# Altium project LED_Clock.PrjPcb
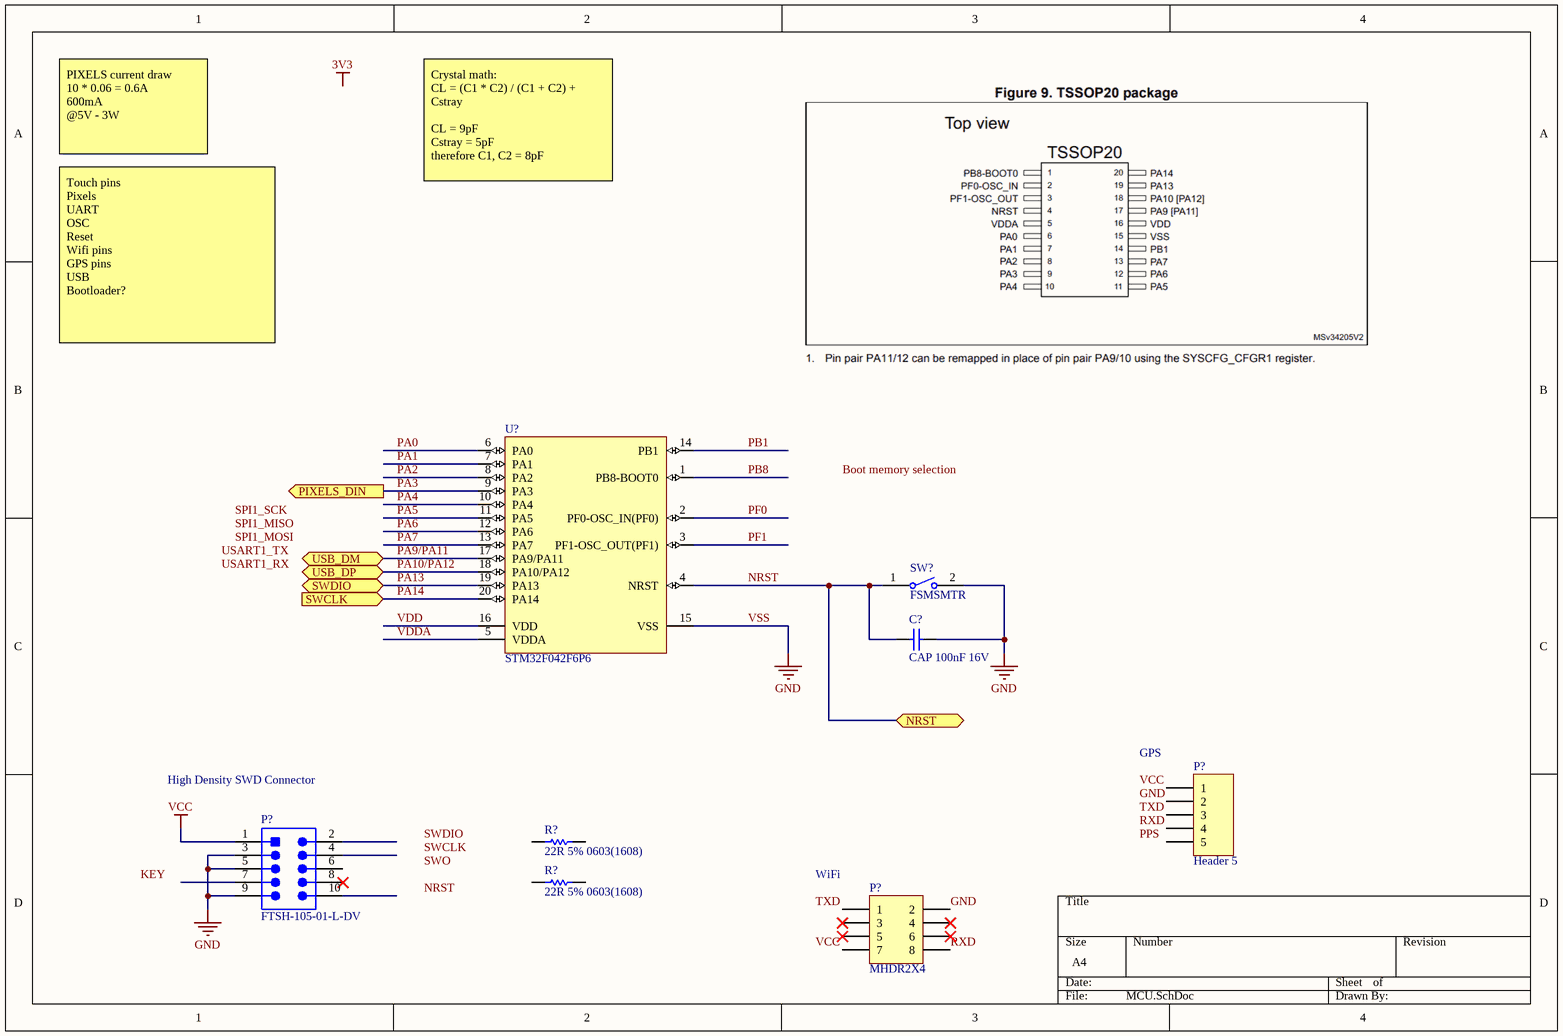
[diagram p0: MCU.SchDoc]
5 sheets, 31 parts. Net scope: flat (ports and power ports of the same name join across sheets).
Sheets:
  MCU.SchDoc
  Pixels.SchDoc
  Peripherals.SchDoc
  Power.SchDoc
  TouchSensing.SchDoc

## Sheet MCU.SchDoc
size A4

### Parts
(Parts that share a designator on the sheet are numbered #1, #2 ... from top to bottom, then left to right.)
C?#1  CAP 100nF 16V  [CAPC0603(1608)100_N]
P?#1  Header 5  [HDR1X5]
P?#2  FTSH-105-01-L-DV  [SMTC-FTSH-105-01-L-DV_V]
P?#3  MHDR2X4  [MHDR2X4]
R?#1  22R 5% 0603(1608)  [RESC0603(1608)_N]
R?#2  22R 5% 0603(1608)  [RESC0603(1608)_N]
SW?  FSMSMTR  [TECO-FSMSMTR_V]
U?#1  STM32F042F6P6  [STM-TSSOP20_M]

### Ports
NRST (bidir), PIXELS_DIN (out), SWCLK (in), SWDIO (bidir), USB_DM (bidir), USB_DP (bidir)

### Nets
GND: C?#1.2 P?#2.3 P?#2.5 P?#2.9 P?#3.2 SW?.2 U?#1.15(VSS)  [also labelled VSS]
VCC: P?#2.1
NRST: C?#1.1 SW?.1 U?#1.4(NRST) ; port NRST
PA0: U?#1.6(PA0)
PA1: U?#1.7(PA1)
PA2: U?#1.8(PA2)
PA3: U?#1.9(PA3) ; port PIXELS_DIN
PA4: U?#1.10(PA4)
PA5: U?#1.11(PA5)
PA6: U?#1.12(PA6)
PA7: U?#1.13(PA7)
PA9/PA11: U?#1.17(PA9/PA11) ; port USB_DM  [project net PA11]
PA10/PA12: U?#1.18(PA10/PA12) ; port USB_DP
PA13: U?#1.19(PA13) ; port SWDIO
PA14: U?#1.20(PA14) ; port SWCLK
PB1: U?#1.14(PB1)
PB8: U?#1.1(PB8-BOOT0)
PF0: U?#1.2(PF0-OSC_IN(PF0))
PF1: U?#1.3(PF1-OSC_OUT(PF1))
RXD: P?#3.8
VDD: U?#1.16(VDD)
VDDA: U?#1.5(VDDA)

Not connected (* = marked no-connect by the designer): P?#1 1 2 3 4 5; P?#2 2 4 6 7 8* 10; P?#3 1 3* 4* 5* 6* 7; R?#1 1 2; R?#2 1 2

### Notes on the sheet
- PIXELS current draw
  10 * 0.06 = 0.6A
  600mA
  @5V - 3W
- Crystal math:
  CL = (C1 * C2) / (C1 + C2) + Cstray
  CL = 9pF
  Cstray = 5pF
  therefore C1, C2 = 8pF
- Touch pins
  Pixels
  UART
  OSC
  Reset
  Wifi pins
  GPS pins
  USB
  Bootloader?
- High Density SWD Connector
- (near P?#1) GPS
- (near P?#3) WiFi
- Labels drawn without touching a wire or pin: 3V3, Boot memory selection, GND, KEY, NRST, PPS, RXD, SPI1_MISO, SPI1_MOSI, SPI1_SCK, SWCLK, SWDIO, SWO, TXD, USART1_RX, USART1_TX, VCC

### Library data of the parts
C?#1 = CMP-1035-02584-1: CAP 100nF 16V ±10% 0603 (1608 Metric) Thickness 1mm SMD; Tolerance: Â±10%; Case-EIA: 0603; Case-Metric: 1608; Technology: SMT; Max Thickness: 1 mm; Value: 100nF; Rated Voltage: 16 V
P?#1 = Header 5: Header, 5-Pin; LatestRevisionDate: 17-Jul-2002; LatestRevisionNote: Re-released for DXP Platform.; Publisher: Altium Limited
P?#2 = CMP-2000-05354-1: Male Header, Pitch 1.27 mm, 2 x 5 Position, Height 5.96 mm, -55 to 125 degC, RoHS, Bulk; Manufacturer: Samtec; Connector Type: Header,Unshrouded; Pitch: 0.050"(1.27mm); Mating Products: FLE-105-01-G-DV-TR-ND-CONNSKT1.27MM10POSDUALSMDCLP-105-02-G-D-P-TR-ND-CONNRCPT10POSDUAL.05"SMDSFMC-105-L2-S-D-TR-ND-CONN.05"SURFACE10POSSMTSFMH-105-02-L-D-TR-ND-CONNRECEPT10POS.50"SMTFLE-105-01-G-DV-A-ND-CONNSKT1.27MM10POSDUALSMDCLP-105-02-G-D-BE-ND-CONNRCPT10POSDUAL.05"SMDFLE-105-01-G-DV-A-P-ND-CONNSKT1.27MM10POSDUALSMDSAM1153-05-ND-CONNRCPT10POSDUAL.05"SMDSAM1155-05-ND-CONNRCPT10POSDUAL.05"SMDSAM1154-05-ND-CONNRCPT10POSDUAL.05"SMDSFMH-105-02-L-D-LC-ND-CONNRECEPT10POS.50"SMTSAM1226-05-ND-CONNRCPT.05"10POSDUALSMD; Catalog Drawings: FTSHSeriesFTSHSeriesSMTSide; Other Names: SAM1161-05; EDA / CAD Models: DownloadfromAcceleratedDesigns; Number of Positions Loaded: All; Number of Positions: 10; Featured Product: Board-To-BoardInterconnectSystems; Online Catalog: FTSHSeries; Product Training Modules: Board-to-BoardConnectors; Category: Connectors,Interconnects; Number of Rows: 2; Contact Finish: Gold; Termination: Solder; Mounting Type: SurfaceMount; Series: FTSH; Contact Mating Length: 0.120"(3.05mm); Row Spacing: 0.050"(1.27mm); Datasheet URL: https://datasheet.ciiva.com/30493/0900766b80adfe36-30493006.pdf; Contact Finish Thickness: 10µin(0.25µm); Features: -; Standard Package: 1; Packaging: Bulk; Datasheet Version: Feb-08; Manufacturer URL: http://www.samtec.com/; Fastening Type: -; Family: RectangularConnectors-Headers,MalePins; Contact Type: MalePin; Color: Black
P?#3 = MHDR2X4: Header, 4-Pin, Dual row; LatestRevisionDate: 17-Jul-2002; LatestRevisionNote: Re-released for DXP Platform.; Publisher: Altium Limited
R?#1 R?#2 = CMP-1012-00034-1: 22R 0.1W 5% 0603 (1608 Metric)  SMD; Value: 22.00 Ohm; Case-EIA: 0603; Case-Metric: 1608; Technology: SMT; Power: 0.1 W; Tolerance: 5 %
SW? = CMP-2000-07501-1: FSMSM Push Button Switch, 50 mA, -35 to 85 degC, 2-Pin SMD, RoHS, Tape and Reel; Manufacturer: TE Connectivity; Voltage Rating (DC): 24V; Electrical Life: 20000Cycles; Operating Force: 180gf; Switch Travel: 0.25mm; Contact Current Rating: 50mA; Case\/Package: SMD/SMT; Actuator Length: 1.07mm; Throw Configuration: SPST; Actuator Material: Polyamide; Contact Resistance: 100mOhm; Illumination Type: Illuminated; Max Voltage Rating (DC): 12V; Manufacturer URL: http://www.te.com/; Lead Free: LeadFree; Packaging: TapeandReel; Min Operating Temperature: -35degC; Mechanical Life: 20000Cycles; Mount: SurfaceMount; REACH SVHC: Unknown; Package Quantity: 1800; Package Reference: FSMSMTR; RoHSCompliant: true; Max Operating Temperature: 85degC; Orientation: Straight; ELV: Compliant; Datasheet URL: http://www.te.com/commerce/DocumentDelivery/DDEController?Action=showdoc&DocId=Customer+Drawing%7F1437566-3%7FC2%7Fpdf%7FEnglish%7FENG_CD_1437566-3_C2_1437566_3_1_c.dwg.pdf%7F1437566-4; Package Description: 2-Pin Surface Mount Device, Body 6 x 3.5 mm, Pitch 9.19 mm; Current Rating: 50mA; Contact Plating: Silver; Termination: GullWing; Datasheet Version: Rev. C2, 08/2014; Contact Material: Brass; Mounting Technology: SurfaceMount
U?#1 = CMP-0304-00108-2: ARM Cortex-M0 32-bit MCU, 32 KB Flash, 6 KB Internal RAM, 16 I/Os, 20-Pin TSSOP, -40 to 85 degC, Tube; Manufacturer: STMicroelectronics; Package Description: 20-Pin Thin Shrink Small Outline Package, Body 6.5 x 4.4 mm, Pitch 0.65 mm; ComponentLink1URL: http://www.st.com/; ComponentLink2Description: Datasheet; Package Reference: TSSOP20; ComponentLink2URL: http://www.st.com/st-web-ui/static/active/en/resource/technical/document/datasheet/DM00105814.pdf; ComponentLink1Description: Manufacturer URL; Mounting Technology: Surface Mount; Core: ARM Cortex-M0; PartNumber: STM32F042F6P6; DatasheetVersion: Rev. 5

## Sheet Pixels.SchDoc
size A4
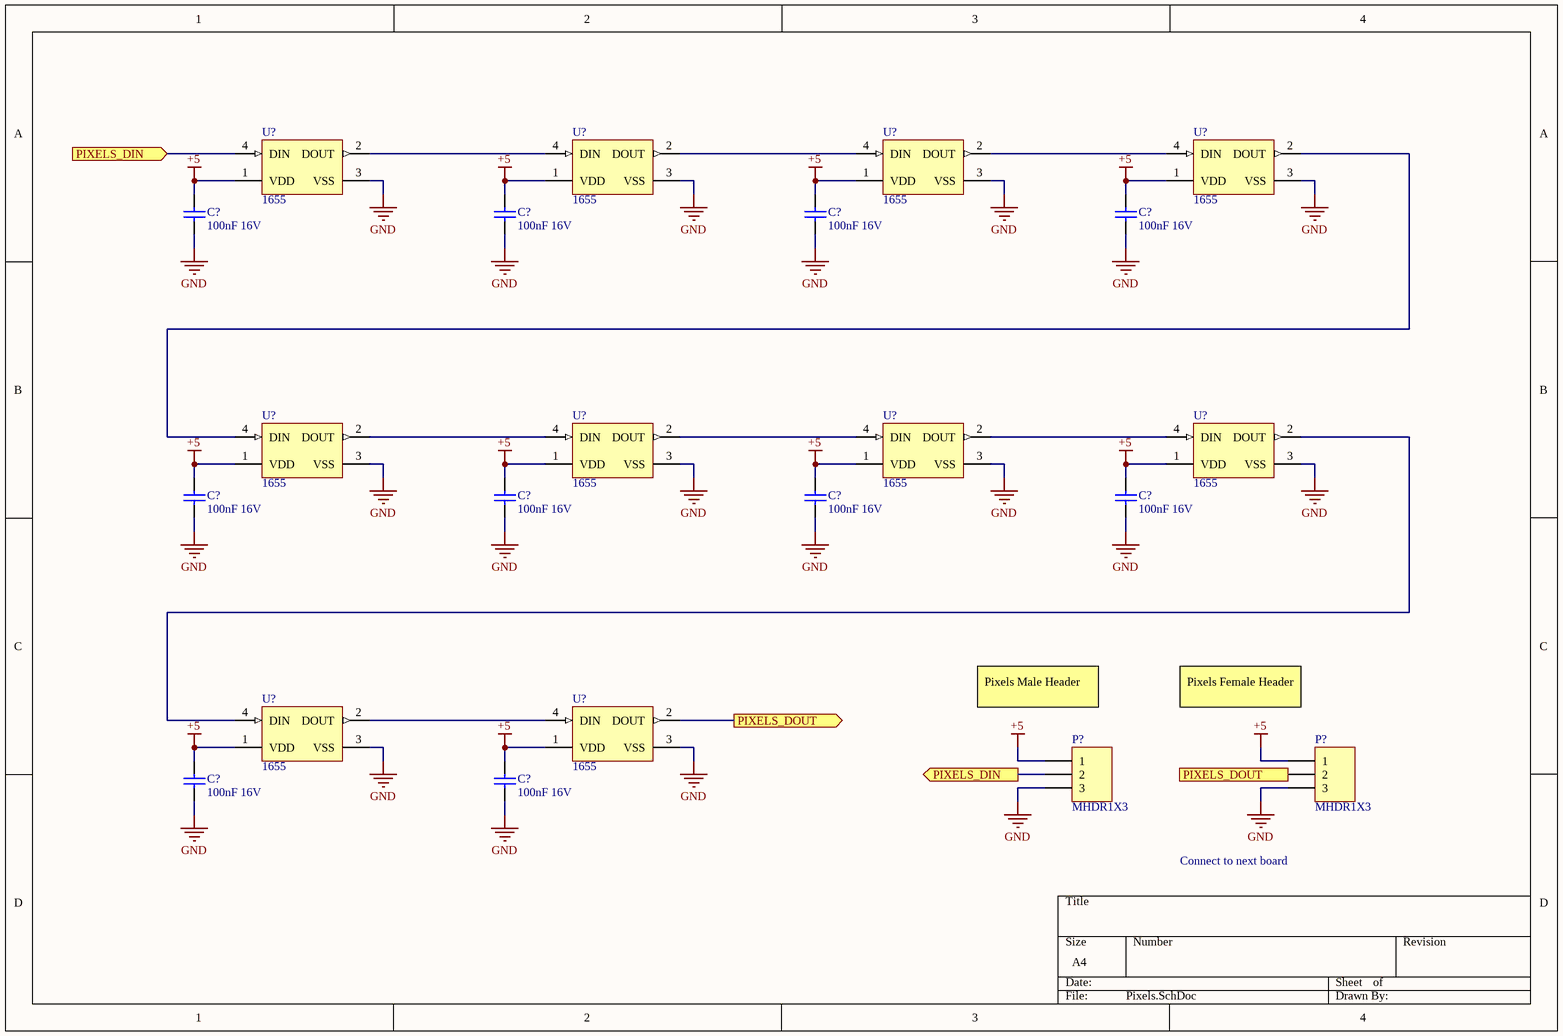
[diagram p1: Pixels.SchDoc]

### Parts
(Parts that share a designator on the sheet are numbered #1, #2 ... from top to bottom, then left to right.)
C?#2  100nF 16V  [CAPC0603(1608)100_N]
C?#3  100nF 16V  [CAPC0603(1608)100_N]
C?#4  100nF 16V  [CAPC0603(1608)100_N]
C?#5  100nF 16V  [CAPC0603(1608)100_N]
C?#6  100nF 16V  [CAPC0603(1608)100_N]
C?#7  100nF 16V  [CAPC0603(1608)100_N]
C?#8  100nF 16V  [CAPC0603(1608)100_N]
C?#9  100nF 16V  [CAPC0603(1608)100_N]
C?#10  100nF 16V  [CAPC0603(1608)100_N]
C?#11  100nF 16V  [CAPC0603(1608)100_N]
P?#4  MHDR1X3  [MHDR1X3]
P?#5  MHDR1X3  [MHDR1X3]
U?#2  1655  [ADA-RGB-1655_V]
U?#3  1655  [ADA-RGB-1655_V]
U?#4  1655  [ADA-RGB-1655_V]
U?#5  1655  [ADA-RGB-1655_V]
U?#6  1655  [ADA-RGB-1655_V]
U?#7  1655  [ADA-RGB-1655_V]
U?#8  1655  [ADA-RGB-1655_V]
U?#9  1655  [ADA-RGB-1655_V]
U?#10  1655  [ADA-RGB-1655_V]
U?#11  1655  [ADA-RGB-1655_V]

### Ports
PIXELS_DIN (in), PIXELS_DIN (out), PIXELS_DOUT (in), PIXELS_DOUT (out)

### Nets
+5: C?#2.2 C?#3.2 C?#4.2 C?#5.2 C?#6.2 C?#7.2 C?#8.2 C?#9.2 C?#10.2 C?#11.2 P?#4.1 P?#5.1 U?#2.1(VDD) U?#3.1(VDD) U?#4.1(VDD) U?#5.1(VDD) U?#6.1(VDD) U?#7.1(VDD) U?#8.1(VDD) U?#9.1(VDD) U?#10.1(VDD) U?#11.1(VDD)
GND: C?#2.1 C?#3.1 C?#4.1 C?#5.1 C?#6.1 C?#7.1 C?#8.1 C?#9.1 C?#10.1 C?#11.1 P?#4.3 P?#5.3 U?#2.3(VSS) U?#3.3(VSS) U?#4.3(VSS) U?#5.3(VSS) U?#6.3(VSS) U?#7.3(VSS) U?#8.3(VSS) U?#9.3(VSS) U?#10.3(VSS) U?#11.3(VSS)
PA3: P?#4.2 U?#2.4(DIN) ; port PIXELS_DIN
NetP?#5_2: P?#5.2 U?#11.2(DOUT) ; port PIXELS_DOUT
NetU?#2_2: U?#2.2(DOUT) U?#3.4(DIN)
NetU?#3_2: U?#3.2(DOUT) U?#4.4(DIN)
NetU?#4_2: U?#4.2(DOUT) U?#5.4(DIN)
NetU?#5_2: U?#5.2(DOUT) U?#6.4(DIN)
NetU?#6_2: U?#6.2(DOUT) U?#7.4(DIN)
NetU?#7_2: U?#7.2(DOUT) U?#8.4(DIN)
NetU?#8_2: U?#8.2(DOUT) U?#9.4(DIN)
NetU?#9_2: U?#9.2(DOUT) U?#10.4(DIN)
NetU?#10_2: U?#10.2(DOUT) U?#11.4(DIN)

### Notes on the sheet
- Pixels Male Header
- Pixels Female Header
- Connect to next board

### Library data of the parts
C?#2-C?#11 = CMP-1035-02584-1: as C?#1 on sheet MCU; Technology: SMT; Max Thickness: 1 mm; Value: 100nF; Rated Voltage: 16 V
P?#4 P?#5 = MHDR1X3: Header, 3-Pin; LatestRevisionDate: 17-Jul-2002; LatestRevisionNote: Re-released for DXP Platform.; Publisher: Altium Limited
U?#2-U?#11 = CMP-2000-05026-1: Intelligent Control LED Integrated Light Source, 3.5 to 5.3 V, -25 to 80 degC, 4-Pin SMD, RoHS, Tape and Reel; Manufacturer: Adafruit-Industries-LLC; Number of LEDs: 10; Configuration: Discrete; Utilized LED: WS2812(5050); Datasheet URL: http://datasheet.octopart.com/ADA1655-Adafruit-Industries-datasheet-32028139.pdf; Series: Neopixel; Interface: -; Package Description: 4-Pin Surface Mount Device, Body 5 x 5 mm; Color: Red,Green,Blue(RGB); Category: Optoelectronics; Controller Type: -; Package Reference: 1655; Manufacturer URL: https://www.adafruit.com/; Mounting Type: SurfaceMount; Datasheet Version: May-13; Size / Dimension: 5.00mmLx5.00mmW; Family: Addressable,Specialty

## Sheet Peripherals.SchDoc
size A4
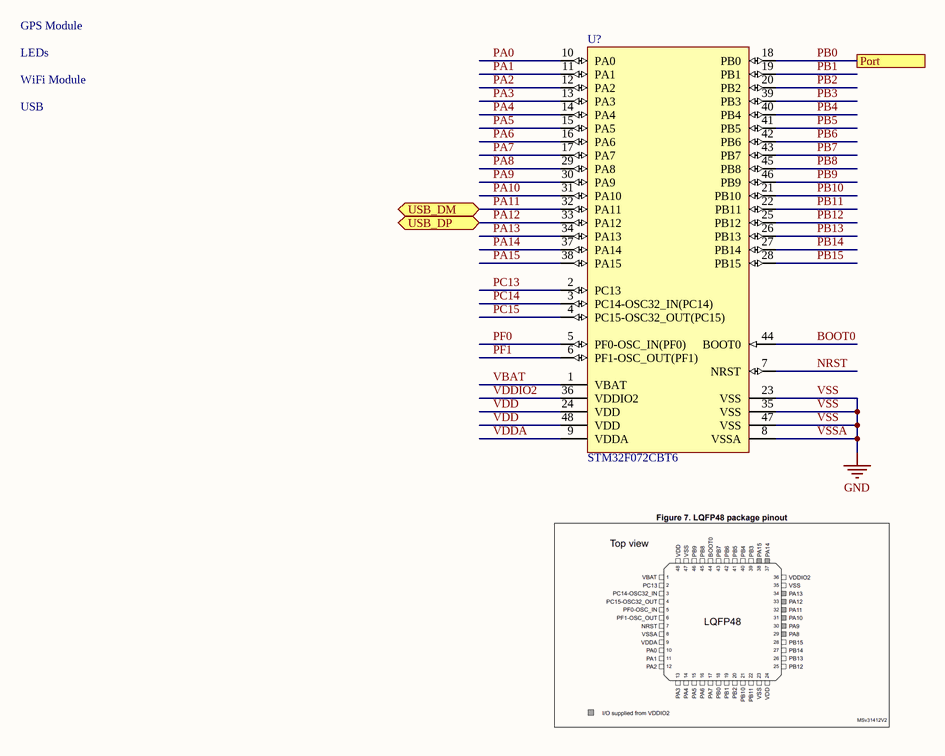
[diagram p2: Peripherals.SchDoc]

### Parts
(Parts that share a designator on the sheet are numbered #1, #2 ... from top to bottom, then left to right.)
U?#12  STM32F072CBT6  [STM-LQFP48_M]

### Ports
Port, USB_DM (bidir), USB_DP (bidir)

### Nets
GND: U?#12.8(VSSA) U?#12.23(VSS) U?#12.35(VSS) U?#12.47(VSS)  [also labelled VSS, VSSA]
BOOT0: U?#12.44(BOOT0)
NRST: U?#12.7(NRST)
PA0: U?#12.10(PA0)
PA1: U?#12.11(PA1)
PA2: U?#12.12(PA2)
PA3: U?#12.13(PA3)
PA4: U?#12.14(PA4)
PA5: U?#12.15(PA5)
PA6: U?#12.16(PA6)
PA7: U?#12.17(PA7)
PA8: U?#12.29(PA8)
PA9: U?#12.30(PA9)
PA10: U?#12.31(PA10)
PA11: U?#12.32(PA11) ; port USB_DM
PA12: U?#12.33(PA12) ; port USB_DP  [project net PA10/PA12]
PA13: U?#12.34(PA13)
PA14: U?#12.37(PA14)
PA15: U?#12.38(PA15)
PB0: U?#12.18(PB0) ; port Port
PB1: U?#12.19(PB1)
PB2: U?#12.20(PB2)
PB3: U?#12.39(PB3)
PB4: U?#12.40(PB4)
PB5: U?#12.41(PB5)
PB6: U?#12.42(PB6)
PB7: U?#12.43(PB7)
PB8: U?#12.45(PB8)
PB9: U?#12.46(PB9)
PB10: U?#12.21(PB10)
PB11: U?#12.22(PB11)
PB12: U?#12.25(PB12)
PB13: U?#12.26(PB13)
PB14: U?#12.27(PB14)
PB15: U?#12.28(PB15)
PC13: U?#12.2(PC13)
PC14: U?#12.3(PC14-OSC32_IN(PC14))
PC15: U?#12.4(PC15-OSC32_OUT(PC15))
PF0: U?#12.5(PF0-OSC_IN(PF0))
PF1: U?#12.6(PF1-OSC_OUT(PF1))
VBAT: U?#12.1(VBAT)
VDD: U?#12.24(VDD) U?#12.48(VDD)
VDDA: U?#12.9(VDDA)
VDDIO2: U?#12.36(VDDIO2)

### Notes on the sheet
- GPS Module
- LEDs
- WiFi Module
- USB

### Library data of the parts
U?#12 = CMP-0304-00170-2: ARM Cortex-M0 32-bit MCU, 128 KB Flash, 16 KB Internal RAM, 37 I/Os, 48-Pin LQFP, -40 to 85 degC, Tray; Manufacturer: STMicroelectronics; I/Os (High Current): 37; Operating Frequency(F) (Processor speed) (MHz): 48; FLASH Size (Prog) (kB): 128; Internal RAM Size (kB): 16; D/A Converter: 1; Supply Voltage(Vcc) min (V): 2; ComponentLink2URL: http://www.st.com/st-web-ui/static/active/en/resource/technical/document/datasheet/DM00090510.pdf; Packing: Tray; DatasheetVersion: Rev. 5; ComponentLink2Description: Datasheet; Package Reference: LQFP48; Core: ARM Cortex-M0; PartNumber: STM32F072CBT6; ComponentLink1Description: Manufacturer URL; Package Description: 48-Pin Low Profile Quad Flat Package, Body 7 x 7 mm, Pitch 0.5 mm; ComponentLink1URL: http://www.st.com/; Mounting Technology: Surface Mount

## Sheet Power.SchDoc
size A4

## Sheet TouchSensing.SchDoc
size A4

## Nets that join several sheets
GND: MCU (7 pins), Pixels (22 pins), Peripherals (U?#12.8 U?#12.23 U?#12.35 U?#12.47)
PA3: MCU (U?#1.9), Pixels (P?#4.2 U?#2.4)
PA10/PA12: MCU (U?#1.18), Peripherals (U?#12.33)
PA11: MCU (U?#1.17), Peripherals (U?#12.32)